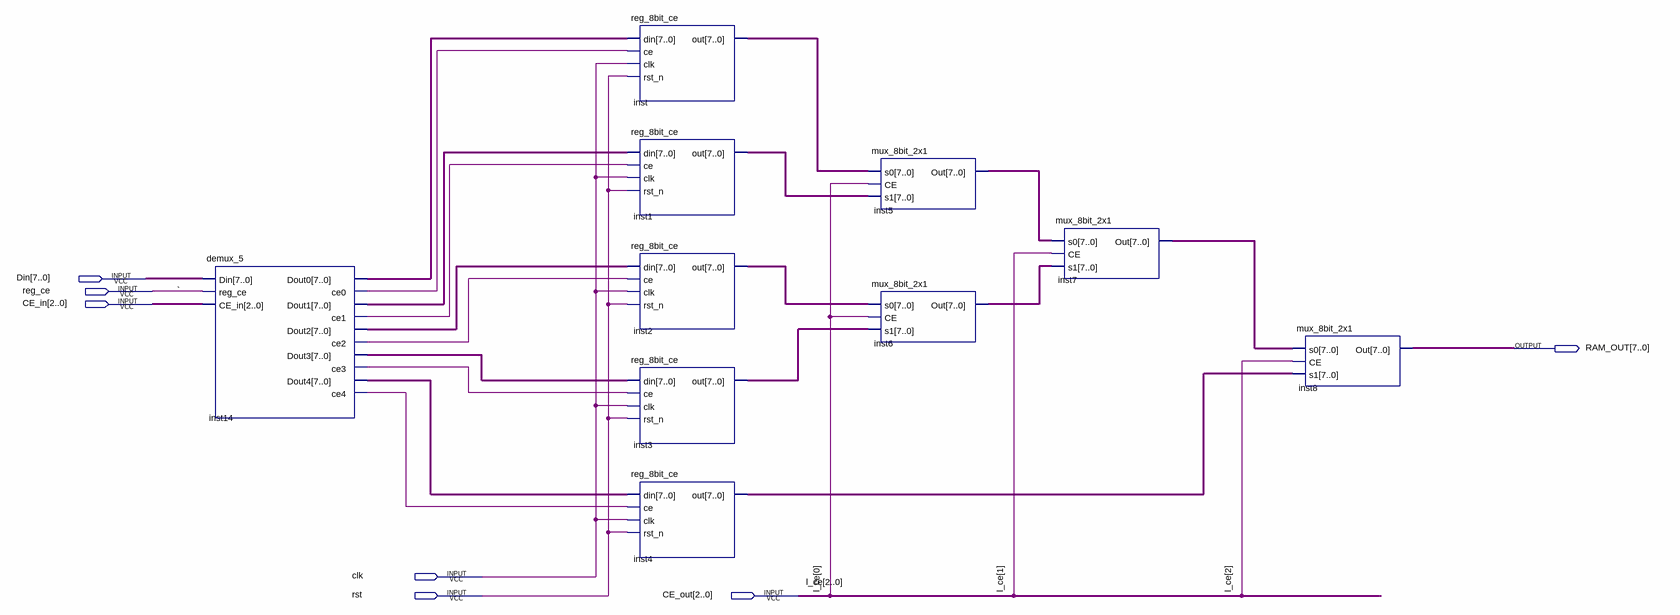
[diagram p0: schematic sheet]
// Quartus schematic Block1.bdf as structural Verilog: 10 symbols, 7 pins
module Block1 (
  input  [7:0] Din,
  input  reg_ce,
  input  [2:0] CE_in,
  input  clk,
  input  rst,
  input  [2:0] CE_out,
  output [7:0] RAM_OUT
);

  wire \` , inst14_ce0, inst14_ce1, inst14_ce2, inst14_ce3, inst14_ce4;
  wire [7:0] inst1_out, inst2_out, inst3_out, inst4_out, inst5_out, inst6_out, inst7_out, inst14_dout0,
       inst14_dout1, inst14_dout2, inst14_dout3, inst14_dout4, inst_out;

  demux_5 inst14 (
    .Din(Din), .reg_ce(reg_ce), .CE_in({3{\` }}), .Dout0(inst14_dout0), .ce0(inst14_ce0),
    .Dout1(inst14_dout1), .ce1(inst14_ce1), .Dout2(inst14_dout2), .ce2(inst14_ce2), .Dout3(inst14_dout3),
    .ce3(inst14_ce3), .Dout4(inst14_dout4), .ce4(inst14_ce4));
  reg_8bit_ce inst (.din(inst14_dout0), .ce(inst14_ce0), .clk(clk), .rst_n(rst), .out(inst_out));
  reg_8bit_ce inst1 (.din(inst14_dout1), .ce(inst14_ce1), .clk(clk), .rst_n(rst), .out(inst1_out));
  reg_8bit_ce inst2 (.din(inst14_dout2), .ce(inst14_ce2), .clk(clk), .rst_n(rst), .out(inst2_out));
  reg_8bit_ce inst3 (.din(inst14_dout3), .ce(inst14_ce3), .clk(clk), .rst_n(rst), .out(inst3_out));
  reg_8bit_ce inst4 (.din(inst14_dout4), .ce(inst14_ce4), .clk(clk), .rst_n(rst), .out(inst4_out));
  mux_8bit_2x1 inst5 (.s0(inst_out), .CE(CE_out[0]), .s1(inst1_out), .Out(inst5_out));
  mux_8bit_2x1 inst6 (.s0(inst2_out), .CE(CE_out[0]), .s1(inst3_out), .Out(inst6_out));
  mux_8bit_2x1 inst7 (.s0(inst5_out), .CE(CE_out[1]), .s1(inst6_out), .Out(inst7_out));
  mux_8bit_2x1 inst8 (.s0(inst7_out), .CE(CE_out[2]), .s1(inst4_out), .Out(RAM_OUT));

  // Other names for the same wires on the sheet: l_ce[2:0] = CE_out
endmodule
